# Altium schematic sheet MCU&Net.SchDoc
size A4
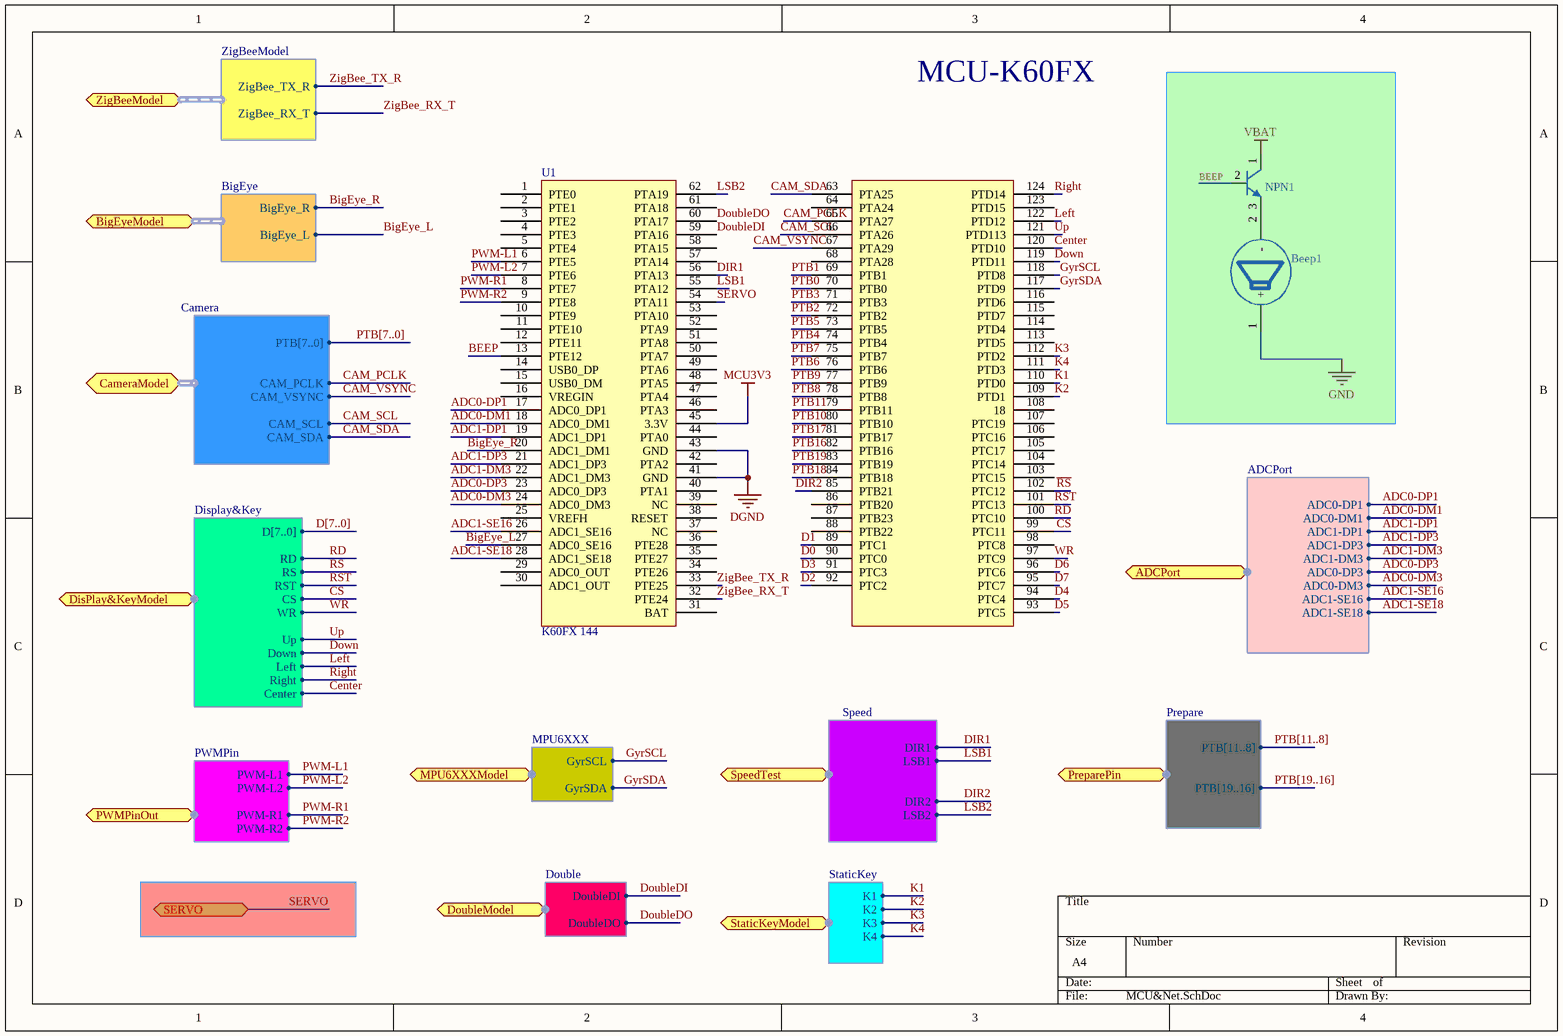
[diagram p0: MCU&Net.SchDoc]

## Parts
Beep1  BEEP  [BEEP]  (value not drawn)
NPN1  NPN  [三极管  NPN]  (value not drawn)
U1  K60FX 144  [K60FX 144]

## Ports
ADCPort (harness ADCPort), BigEyeModel (harness BigEye), CameraModel (harness Camera), DisPlay&KeyModel (harness Display&Key), DoubleModel (harness Double), MPU6XXXModel (harness MPU6XXX), PreparePin (harness Prepare), PWMPinOut (harness PWMPin), SERVO, SpeedTest (harness Speed), StaticKeyModel (harness StaticKey), ZigBeeModel (harness ZigBeeModel)

## Harnesses
Camera: PTB[7..0], CAM_PCLK, CAM_SCL, CAM_VSYNC, CAM_SDA
ZigBeeModel: ZigBee_TX_R, ZigBee_RX_T
BigEye: BigEye_R, BigEye_L
Display&Key: D[7..0], RD, RS, RST, CS, Up, Down, Left, Right, Center, WR
PWMPin: PWM-L1, PWM-L2, PWM-R1, PWM-R2
MPU6XXX: GyrSCL, GyrSDA
Double: DoubleDI, DoubleDO
Speed: DIR1, LSB1, LSB2, DIR2
StaticKey: K1, K2, K3, K4
Prepare: PTB[11..8], PTB[19..16]
ADCPort: ADC0-DP1, ADC0-DM1, ADC1-DP1, ADC1-DP3, ADC1-DM3, ADC0-DP3, ADC0-DM3, ADC1-SE16, ADC1-SE18

## Nets
DGND: U1.41(GND) U1.43(GND)
GND: Beep1.1(+)
MCU3V3: U1.45(3.3V)
VBAT: NPN1.1
ADC0-DM1: U1.18(ADC0_DM1) ; port ADCPort.ADC0-DM1
ADC0-DM3: U1.24(ADC0_DM3) ; port ADCPort.ADC0-DM3
ADC0-DP1: U1.17(ADC0_DP1) ; port ADCPort.ADC0-DP1
ADC0-DP3: U1.23(ADC0_DP3) ; port ADCPort.ADC0-DP3
ADC1-DM3: U1.22(ADC1_DM3) ; port ADCPort.ADC1-DM3
ADC1-DP1: U1.19(ADC1_DP1) ; port ADCPort.ADC1-DP1
ADC1-DP3: U1.21(ADC1_DP3) ; port ADCPort.ADC1-DP3
ADC1-SE16: U1.26(ADC1_SE16) ; port ADCPort.ADC1-SE16
ADC1-SE18: U1.28(ADC1_SE18) ; port ADCPort.ADC1-SE18
BEEP: NPN1.2 U1.13(PTE12)
BigEye_L: U1.27(ADC0_SE16) ; port BigEyeModel.BigEye_L
BigEye_R: U1.20(ADC1_DM1) ; port BigEyeModel.BigEye_R
CAM_PCLK: U1.65(PTA27) ; port CameraModel.CAM_PCLK
CAM_SCL: U1.66(PTA26) ; port CameraModel.CAM_SCL
CAM_SDA: U1.63(PTA25) ; port CameraModel.CAM_SDA
CAM_VSYNC: U1.67(PTA29) ; port CameraModel.CAM_VSYNC
Center: U1.120(PTD10) ; port DisPlay&KeyModel.Center
CS: U1.99(PTC11) ; port DisPlay&KeyModel.CS
D0: U1.90(PTC0)
D1: U1.89(PTC1)
D2: U1.92(PTC2)
D3: U1.91(PTC3)
D4: U1.94(PTC4)
D5: U1.93(PTC5)
D6: U1.96(PTC6)
D7: U1.95(PTC7)
DIR1: U1.56(PTA13) ; port SpeedTest.DIR1
DIR2: U1.85(PTB21) ; port SpeedTest.DIR2
DoubleDI: U1.59(PTA16) ; port DoubleModel.DoubleDI
DoubleDO: U1.60(PTA17) ; port DoubleModel.DoubleDO
Down: U1.119(PTD11) ; port DisPlay&KeyModel.Down
GyrSCL: U1.118(PTD8) ; port MPU6XXXModel.GyrSCL
GyrSDA: U1.117(PTD9) ; port MPU6XXXModel.GyrSDA
K1: U1.110(PTD0) ; port StaticKeyModel.K1
K2: U1.109(PTD1) ; port StaticKeyModel.K2
K3: U1.112(PTD2) ; port StaticKeyModel.K3
K4: U1.111(PTD3) ; port StaticKeyModel.K4
Left: U1.122(PTD12) ; port DisPlay&KeyModel.Left
LSB1: U1.55(PTA12) ; port SpeedTest.LSB1
LSB2: U1.62(PTA19) ; port SpeedTest.LSB2
PTB0: U1.70(PTB0)
PTB1: U1.69(PTB1)
PTB2: U1.72(PTB2)
PTB3: U1.71(PTB3)
PTB4: U1.74(PTB4)
PTB5: U1.73(PTB5)
PTB6: U1.76(PTB6)
PTB7: U1.75(PTB7)
PTB8: U1.78(PTB8)
PTB9: U1.77(PTB9)
PTB10: U1.80(PTB10)
PTB11: U1.79(PTB11)
PTB16: U1.82(PTB16)
PTB17: U1.81(PTB17)
PTB18: U1.84(PTB18)
PTB19: U1.83(PTB19)
PWM-L1: U1.6(PTE5) ; port PWMPinOut.PWM-L1
PWM-L2: U1.7(PTE6) ; port PWMPinOut.PWM-L2
PWM-R1: U1.8(PTE7) ; port PWMPinOut.PWM-R1
PWM-R2: U1.9(PTE8) ; port PWMPinOut.PWM-R2
~{RS}: U1.102(PTC12) ; port DisPlay&KeyModel.RS
RD: U1.100(PTC10) ; port DisPlay&KeyModel.RD
Right: U1.124(PTD14) ; port DisPlay&KeyModel.Right
RST: U1.101(PTC13) ; port DisPlay&KeyModel.RST
SERVO: U1.54(PTA11) ; port SERVO
Up: U1.121(PTD113) ; port DisPlay&KeyModel.Up
WR: U1.97(PTC9) ; port DisPlay&KeyModel.WR
ZigBee_RX_T: U1.32(PTE24) ; port ZigBeeModel.ZigBee_RX_T
ZigBee_TX_R: U1.33(PTE25) ; port ZigBeeModel.ZigBee_TX_R
NetBeep1_2: Beep1.2(-) NPN1.3

Not connected (* = marked no-connect by the designer): U1 1(PTE0) 2(PTE1) 3(PTE2) 4(PTE3) 5(PTE4) 10(PTE9) 11(PTE10) 12(PTE11) 14(USB0_DP) 15(USB0_DM) 16(VREGIN) 25(VREFH) 29(ADC0_OUT) 30(ADC1_OUT) 31(BAT) 34(PTE26) 35(PTE27) 36(PTE28) 37(NC) 38(RESET) 39(NC) 40(PTA1) 42(PTA2) 44(PTA0) 46(PTA3) 47(PTA4) 48(PTA5) 49(PTA6) 50(PTA7) 51(PTA8) 52(PTA9) 53(PTA10) 57(PTA14) 58(PTA15) 61(PTA18) 64(PTA24) 68(PTA28) 86(PTB20) 87(PTB23) 88(PTB22) 98(PTC8) 103(PTC15) 104(PTC14) 105(PTC17) 106(PTC16) 107(PTC19) 108(18) 113(PTD5) 114(PTD4) 115(PTD7) 116(PTD6) 123(PTD15)

## Buses and harness runs
bus D[7..0]
bus PTB[7..0]
bus PTB[11..8]
bus PTB[19..16]

## Notes on the sheet
- MCU-K60FX

## Library data of the parts
Beep1 = 蜂鸣器
U1 = K60FX   144